# Altium schematic sheet AVR.SchDoc
size A; SheetNumber: 2; SheetTotal: 3
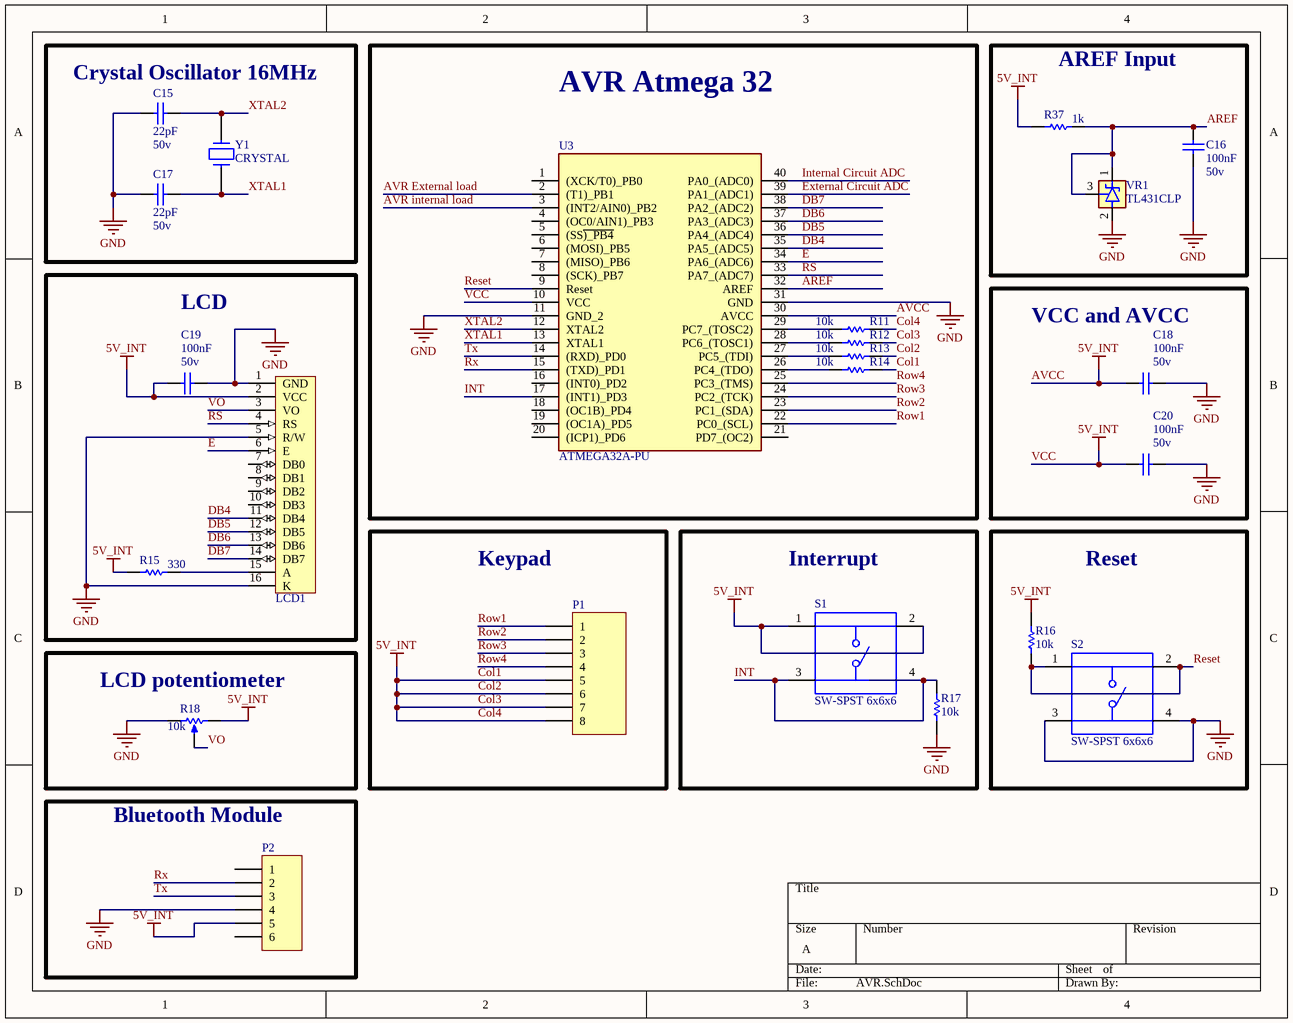
[diagram p0: AVR.SchDoc]

## Parts
C15  Volte: 50v  [C0805]  (hidden comment: 22pF)
C16  Volte: 50v  [C0805]  (hidden comment: 100nF)
C17  Volte: 50v  [C0805]  (hidden comment: 22pF)
C18  Volte: 50v  [C0805]  (hidden comment: 100nF)
C19  Volte: 50v  [C0805]  (hidden comment: 100nF)
C20  Volte: 50v  [C0805]  (hidden comment: 100nF)
LCD1  LCD 16X2  [My_LCD 16x2-A]  (value not drawn)
P1  Header 8  [MY_1X08]  (value not drawn)
P2  Header 6  [MY_FE06]  (value not drawn)
R11  10k  [R0603]
R12  10k  [R0603]
R13  10k  [R0603]
R14  10k  [R0603]
R15  330  [MY_(0.25w)_0207_10]
R16  10k  [R0603]
R17  10k  [R0603]
R18  10k  [MY_TRIM3296W]
R37  1k  [R0603]
S1  SW-SPST 6x6x6  [SW-SPST 6x6x6]
S2  SW-SPST 6x6x6  [SW-SPST 6x6x6]
U3  ATMEGA32A-PU  [DIP40]
VR1  TL431CLP  [TO-92]
Y1  CRYSTAL  [My_Crystal]

## Blocks framed on the sheet
Crystal Oscillator 16MHz: C15 C17 Y1
AVR Atmega 32: R11-R14 U3
AREF Input: C16 R37 VR1
LCD: C19 LCD1 R15
VCC and AVCC: C18 C20
Keypad: P1
Interrupt: R17 S1
Reset: R16 S2
LCD potentiometer: R18
Bluetooth Module: P2

## Nets
AVCC: C18.2 C19.2 C20.2 LCD1.2(VCC) P1.5 P1.6 P1.7 P1.8 P2.5 R11.2 R12.2 R13.2 R14.2 R15.1 R16.1 R18.2(BOT) R37.1 S1.1 S1.2 U3.10(VCC) U3.30(AVCC)  [also labelled 5V_INT, Col1, Col2, Col3, Col4, VCC]
GND: C15.1 C16.2 C17.1 C18.1 C19.1 C20.1 LCD1.1(GND) LCD1.5(R/W) LCD1.16(K) P2.4 R17.2 R18.1(TOP) S2.3 S2.4 U3.11(GND_2) U3.31(GND) VR1.2(ANODE)
AREF: C16.1 R37.2 U3.32(AREF) VR1.1(CATHODE) VR1.3(REF)
AVR External load: U3.2((T1)_PB1)
AVR internal load: U3.3((INT2/AIN0)_PB2)
DB4: LCD1.11(DB4) U3.35(PA5_(ADC5))
DB5: LCD1.12(DB5) U3.36(PA4_(ADC4))
DB6: LCD1.13(DB6) U3.37(PA3_(ADC3))
DB7: LCD1.14(DB7) U3.38(PA2_(ADC2))
E: LCD1.6(E) U3.34(PA6_(ADC6))
External Circuit ADC: U3.39(PA1_(ADC1))
INT: R17.1 S1.3 S1.4 U3.17((INT1)_PD3)
Internal Circuit ADC: U3.40(PA0_(ADC0))
Reset: R16.2 S2.1 S2.2 U3.9(Reset)
Row1: P1.1 U3.22(PC0_(SCL))
Row2: P1.2 U3.23(PC1_(SDA))
Row3: P1.3 U3.24(PC2_(TCK))
Row4: P1.4 U3.25(PC3_(TMS))
RS: LCD1.4(RS) U3.33(PA7_(ADC7))
Rx: P2.2 U3.15((TXD)_PD1)
Tx: P2.3 U3.14((RXD)_PD0)
VO: LCD1.3(VO) R18.3(TAP)
XTAL1: C17.2 U3.13(XTAL1) Y1.1
XTAL2: C15.2 U3.12(XTAL2) Y1.2
NetLCD1_15: LCD1.15(A) R15.2
NetR11_1: R11.1 U3.29(PC7_(TOSC2))
NetR12_1: R12.1 U3.28(PC6_(TOSC1))
NetR13_1: R13.1 U3.27(PC5_(TDI))
NetR14_1: R14.1 U3.26(PC4_(TDO))

Not connected (* = marked no-connect by the designer): LCD1 7(DB0) 8(DB1) 9(DB2) 10(DB3); P2 1 6; U3 1((XCK/T0)_PB0) 4((OC0/AIN1)_PB3) 5((SS~{)_PB4}) 6((MOSI)_PB5) 7((MISO)_PB6) 8((SCK)_PB7) 16((INT0)_PD2) 18((OC1B)_PD4) 19((OC1A)_PD5) 20((ICP1)_PD6) 21(PD7_(OC2))

## Library data of the parts
C15-C20 = Cap ceramic: None polar capacitor; ASiD Part Number: C-AS
  C15 C17: Value: 22pF
  C16 C18-C20: Value: 100nF
LCD1 = LCD 16X2: LCD 16X2 Character lcd; ASiD Part Number: LCD 16X2-AS
P1 = Header 8: Header, 8-Pin, Dual row; ASiD Part Number: Header 8-AS
P2 = Header 6: Header, 6-Pin; ASiD Part Number: Header 6-AS
R11-R17 R37 = Res: Standard resistor; ASiD Part Number: Res-AS
  R11-R14 R16 R17: Value: 10k
  R15: Value: 330
  R37: Value: 1k
R18 = Variable Resistor: Potentiometer; ASiD Part Number: Variable Resistor-AS; Value: 10k
S1 S2 = SW-SPST 6x6x6: 6 x 6 mm, 6 mm Actuator Height, 160 gf, Black, Long Crimped, Through Hole, SPST, Tactile Switch; MF: CUI Devices; MP: TS02-66-60-BK-160-LCR-D; CUI_purchase_URL: https://www.cuidevices.com/product/switches/tactile-switches/ts02-series?utm_source=snapeda.com&utm_medium=referral&utm_campaign=snapedaBOM; Check_prices: https://www.snapeda.com/parts/TS02-66-60-BK-160-LCR-D/CUI+Devices/view-part/?ref=eda; Purchase-URL: https://pricing.snapeda.com/search/part/TS02-66-60-BK-160-LCR-D/?ref=eda; Price: None; Availability: In Stock; SnapEDA_Link: https://www.snapeda.com/parts/TS02-66-60-BK-160-LCR-D/CUI+Devices/view-part/?ref=snap; Package: None; Value: *
U3 = ATMEGA32A-PU: AVR AVR ATmega Microcontroller IC 8-Bit 16MHz 32KB (16K x 16) FLASH 40-PDIP; MF: Microchip; SnapEDA_Link: https://www.snapeda.com/parts/ATMEGA32A-PU/Microchip/view-part/?ref=snap; Package: PDIP-40 Microchip; Value: *; MP: ATMEGA32A-PU; Check_prices: https://www.snapeda.com/parts/ATMEGA32A-PU/Microchip/view-part/?ref=eda
VR1 = TL431CLP: Adjustable precision shunt regulator; MF: Texas Instruments; SnapEDA_Link: https://www.snapeda.com/parts/TL431CLP/Texas+Instruments/view-part/?ref=snap; Package: TO-92 Texas Instruments; Value: *; MP: TL431CLP; Check_prices: https://www.snapeda.com/parts/TL431CLP/Texas+Instruments/view-part/?ref=eda
Y1 = CRYSTAL: ASiD Part Number: Crystal-AS